# EAGLE design 32nbIoT-1.2 (EAGLE 9.0.0)
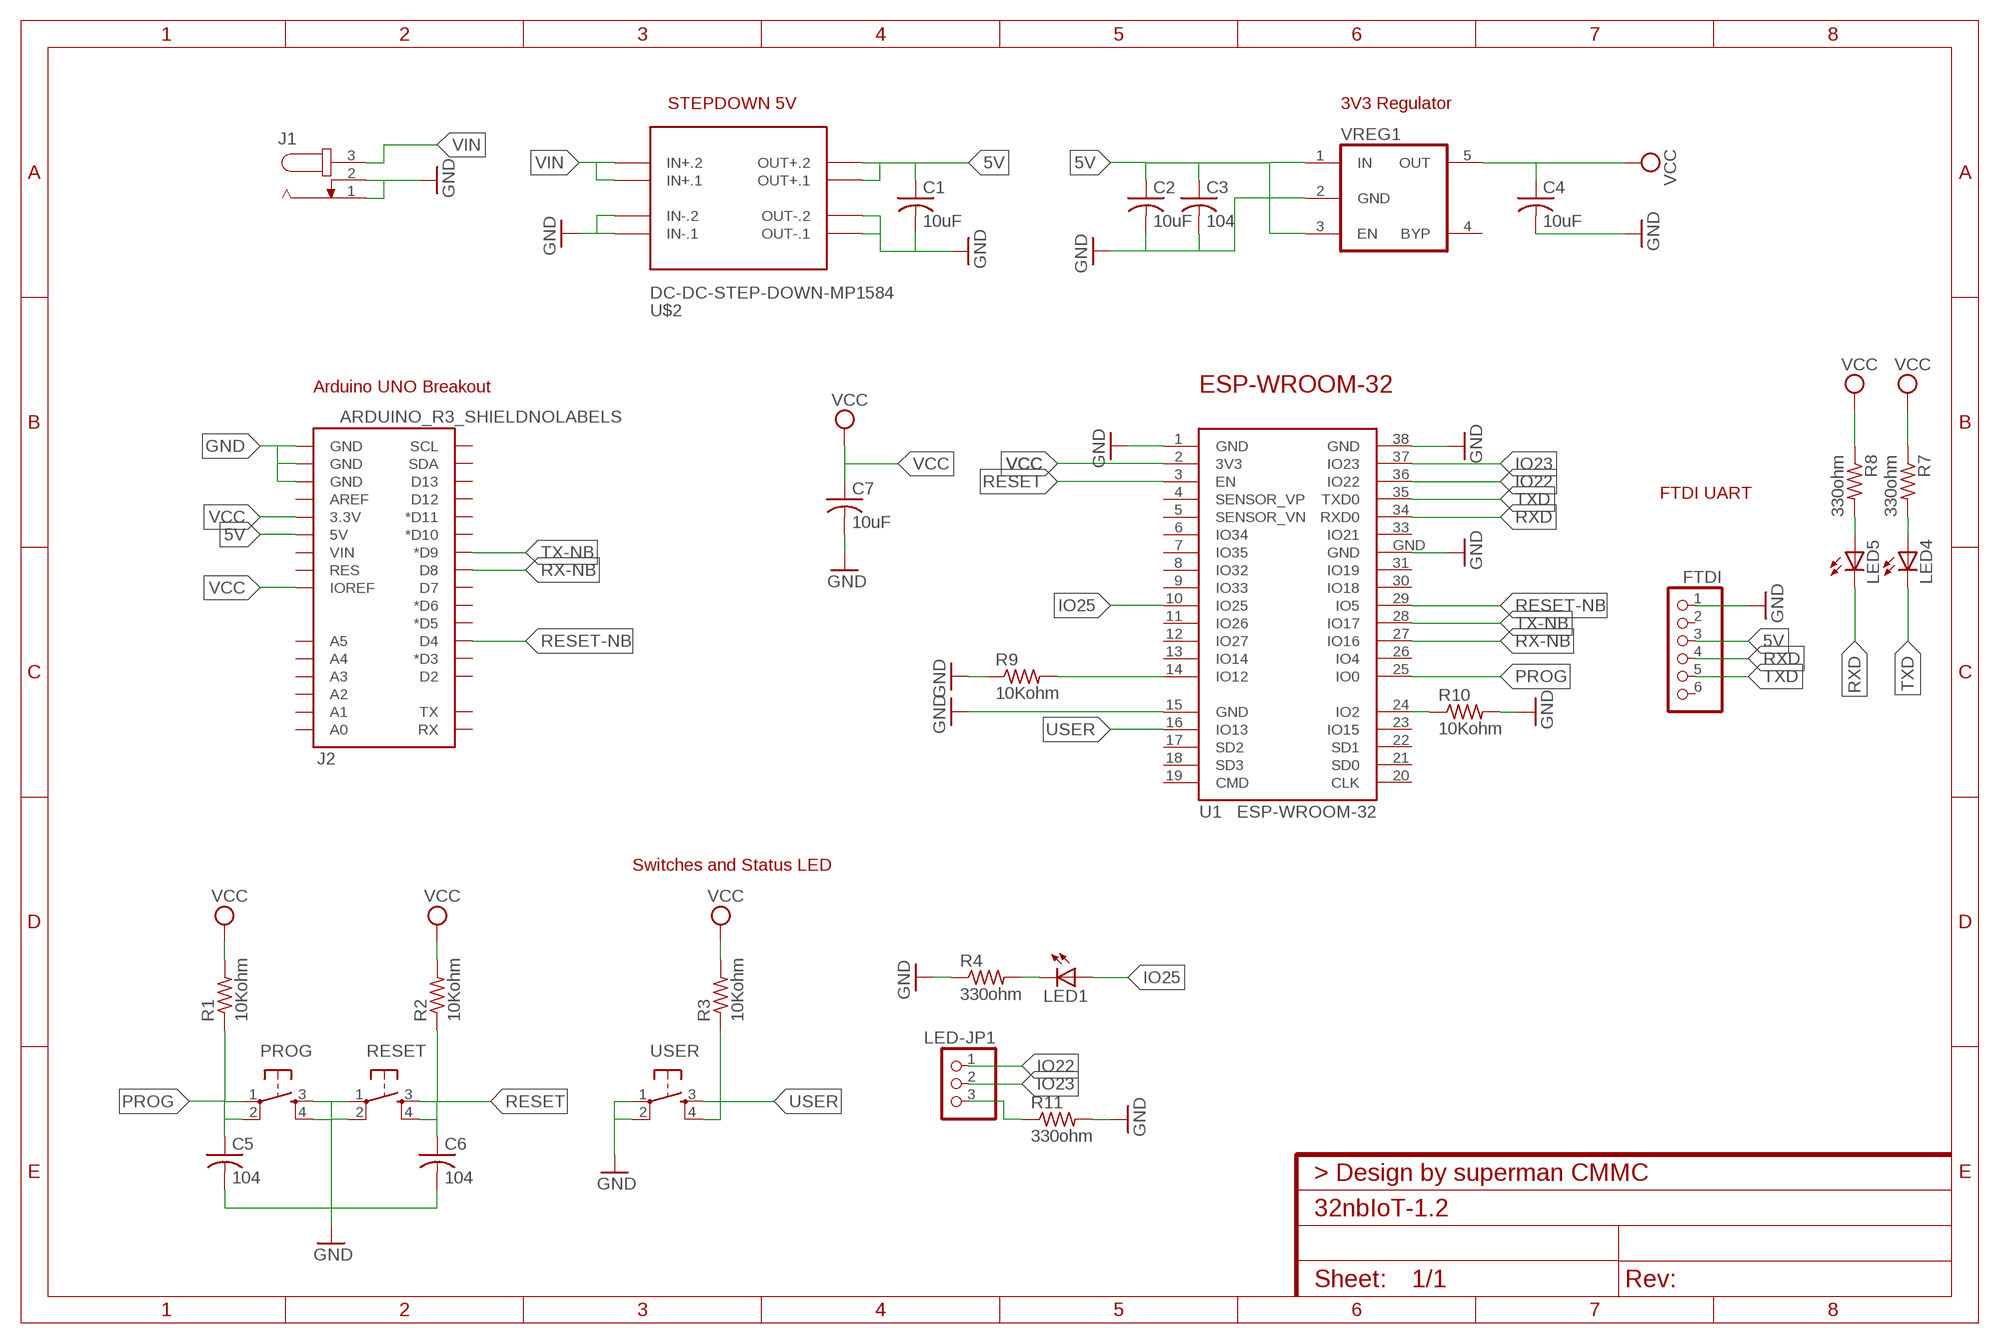
[diagram p0: schematic, sheet 1]

## Parts
C1  10uF  C-USC0805  [C0805]
C2  10uF  C-USC0805  [C0805]
C3  104  C-USC0805  [C0805]
C4  10uF  C-USC0805  [C0805]
C5  104  C-USC0805  [C0805]
C6  104  C-USC0805  [C0805]
C7  10uF  C-USC0805  [C0805]
FTDI  PINHD-1X6  [1X06]
J1  JACK-PLUG1  [SPC4078]
J2  ARDUINO_R3_SHIELDNOLABELS  [UNO_R3_SHIELD_NOLABELS]
LED1  LEDCHIPLED_0805  [CHIPLED_0805]
LED4  LEDCHIPLED_0805  [CHIPLED_0805]
LED5  LEDCHIPLED_0805  [CHIPLED_0805]
LED-JP1  PINHD-1X3/90  [1X03/90]
PROG  TAC_SWITCHPTH  [TACTILE-PTH]
R1  10Kohm  R-US_R0805W  [R0805W]
R2  10Kohm  R-US_R0805W  [R0805W]
R3  10Kohm  R-US_R0805W  [R0805W]
R4  330ohm  R-US_R0805W  [R0805W]
R7  330ohm  R-US_R0805W  [R0805W]
R8  330ohm  R-US_R0805W  [R0805W]
R9  10Kohm  R-US_R0805W  [R0805W]
R10  10Kohm  R-US_R0805W  [R0805W]
R11  330ohm  R-US_R0805W  [R0805W]
RESET  TAC_SWITCHPTH  [TACTILE-PTH]
U1  ESP-WROOM-32  [ESP-WROOM-32]
U$2  DC-DC-STEP-DOWN-MP1584  [DC-DC-STEP-DOWN-MP1584]
USER  TAC_SWITCHPTH  [TACTILE-PTH]
VREG1  VREG_5PINS-SOT-23-5  [SOT-23-5]

## Nets
5V: C1.1 C2.1 C3.1 FTDI.3 J2.5V U$2.OUT+.1 U$2.OUT+.2 VREG1.1(IN) VREG1.3(EN)
GND: C1.2 C2.2 C3.2 C4.2 C5.2 C6.2 C7.2 FTDI.1 J1.1 J1.2 J2.GND@0(GND) J2.GND@1(GND) J2.GND@2(GND) PROG.3 PROG.4 R4.1 R9.1 R10.2 R11.2 RESET.1 RESET.2 U1.1(GND) U1.15(GND) U1.38(GND) U1.GND U$2.IN-.1 U$2.IN-.2 U$2.OUT-.1 U$2.OUT-.2 USER.1 USER.2 VREG1.2(GND)
IO22: LED-JP1.1 U1.36(IO22)
IO23: LED-JP1.2 U1.37(IO23)
IO25: LED1.A U1.10(IO25)
N$1: R10.1 U1.24(IO2)
N$2: R9.2 U1.14(IO12)
N$3: LED1.C R4.2
N$4: LED-JP1.3 R11.1
N$7: LED4.A R7.2
N$8: LED5.A R8.2
PROG: C5.1 PROG.1 PROG.2 R1.1 U1.25(IO0)
RESET: C6.1 R2.1 RESET.3 RESET.4 U1.3(EN)
RESET-NB: J2.D4 U1.29(IO5)
RX-NB: J2.D8 U1.27(IO16)
RXD: FTDI.4 LED5.C U1.34(RXD0)
TX-NB: J2.D9(*D9) U1.28(IO17)
TXD: FTDI.5 LED4.C U1.35(TXD0)
USER: R3.1 U1.16(IO13) USER.3 USER.4
VCC: C4.1 C7.1 J2.3.3V J2.IOREF R1.2 R2.2 R3.2 R7.1 R8.1 U1.2(3V3) VREG1.5(OUT)
VIN: J1.3 U$2.IN+.1 U$2.IN+.2
Unconnected: FTDI.2 FTDI.6 J2.A0 J2.A1 J2.A2 J2.A3 J2.A4 J2.A5 J2.AREF J2.D2 J2.D3(*D3) J2.D5(*D5) J2.D6(*D6) J2.D7 J2.D10(*D10) J2.D11(*D11) J2.D12 J2.D13 J2.RES J2.RX J2.SCL J2.SDA J2.TX J2.VIN U1.4(SENSOR_VP) U1.5(SENSOR_VN) U1.6(IO34) U1.7(IO35) U1.8(IO32) U1.9(IO33) U1.11(IO26) U1.12(IO27) U1.13(IO14) U1.17(SD2) U1.18(SD3) U1.19(CMD) U1.20(CLK) U1.21(SD0) U1.22(SD1) U1.23(IO15) U1.26(IO4) U1.30(IO18) U1.31(IO19) U1.33(IO21) VREG1.4(BYP)

## Notes on the sheet
- STEPDOWN 5V | 3V3 Regulator
- Arduino UNO Breakout | ESP-WROOM-32
- FTDI UART
- Switches and Status LED

## Library data of the parts
C1-C7 = adafruit:C-US: CAPACITOR, American symbol
FTDI = pinhead:PINHD-1X6: PIN HEADER
J1 = con-jack:JACK-PLUG: DC POWER JACK Power Jack, DC, Right Angle, Through Hole, Rated 5A at 16VDC, PC Terminals Distributor: Farnell (www.Farnell.de) Drawing: 84N1161.pdf / 84N1162.pdf Manufacturer: SPC Technology (www.spctechnology.com) Type: SPC4077 / SPC 4078; OC_FARNELL: unknown; OC_NEWARK: unknown
J2 = SparkFun-Boards:ARDUINO_R3_SHIELD: Shield form compatible with the Arduino Uno R3.
LED1 LED4 LED5 = adafruit:LED: LED OSRAM: - CHIPLED LG R971, LG N971, LY N971, LG Q971, LY Q971, LO R971, LY R971 LH N974, LH R974 LS Q976, LO Q976, LY Q976 LO Q996 - Hyper CHIPLED LW Q18S LB Q993, LB Q99A, LB R99A - SideLED LS A670, LO A670, LY A670, LG A670, LP A670 LB A673, LV A673, LT A673, LW A673 LH A674 LY A675 LS A676, LA A676, LO A676, LY A676, LW A676 LS A679, LY A679, LG A679 - Hyper Micro SIDELED® LS Y876, LA Y876, LO Y876, LY Y876 LT Y87S - SmartLED LW L88C, LW L88S LB L89C, LB L89S, LG L890 LS L89K, LO L89K, LY L89K LS L896, LA L896, LO L896, LY L896 - TOPLED LS T670, LO T670, LY T670, LG T670, LP T670 LSG T670, LSP T670, LSY T670, LOP T670, LYG T670 LG T671, LOG T671, LSG T671 LB T673, LV T673, LT T673, LW T673 LH T674 LS T676, LA T676, LO T676, LY T676, LB T676, LH T676, LSB T676, LW T676 LB T67C, LV T67C, LT T67C, LS T67K, LO T67K, LY T67K, LW E67C LS E67B, LA E67B, LO E67B, LY E67B, LB E67C, LV E67C, LT E67C LW T67C LS T679, LY T679, LG T679 LS T770, LO T770, LY T770, LG T770, LP T770 LB T773, LV T773, LT T773, LW T773 LH T774 LS E675, LA E675, LY E675, LS T675 LS T776, LA T776, LO T776, LY T776, LB T776 LHGB T686 LT T68C, LB T68C - Hyper Mini TOPLED® LB M676 - Mini TOPLED Santana® LG M470 LS M47K, LO M47K, LY M47K Source: http://www.osram.convergy.de/
LED-JP1 = pinhead:PINHD-1X3: PIN HEADER
PROG RESET USER = SparkFun-Retired:TAC_SWITCH: Momentary Switch Button commonly used for reset or general input. Spark Fun Electronics SKU : COM-00097 SMT- SWCH-08247
R1-R4 R7-R11 = adafruit:R-US_: RESISTOR, American symbol
U1 = esp32:ESP-WROOM-32: Espressif Systems ESP-WROOM-32
U$2 = diy-modules:DC-DC-STEP-DOWN-MP1584: DC/DC Step-Down Regulator based on MP1584 chip MP1584 datasheet available here: http://www.haoyuelectronics.com/Attachment/MP1584/MP1584.pdf Click here to find device on ebay.com <http://www.ebay.com/sch/mp1584+module>
VREG1 = dp_devices:VREG_5PINS: 5 pins voltage regulator

## Board
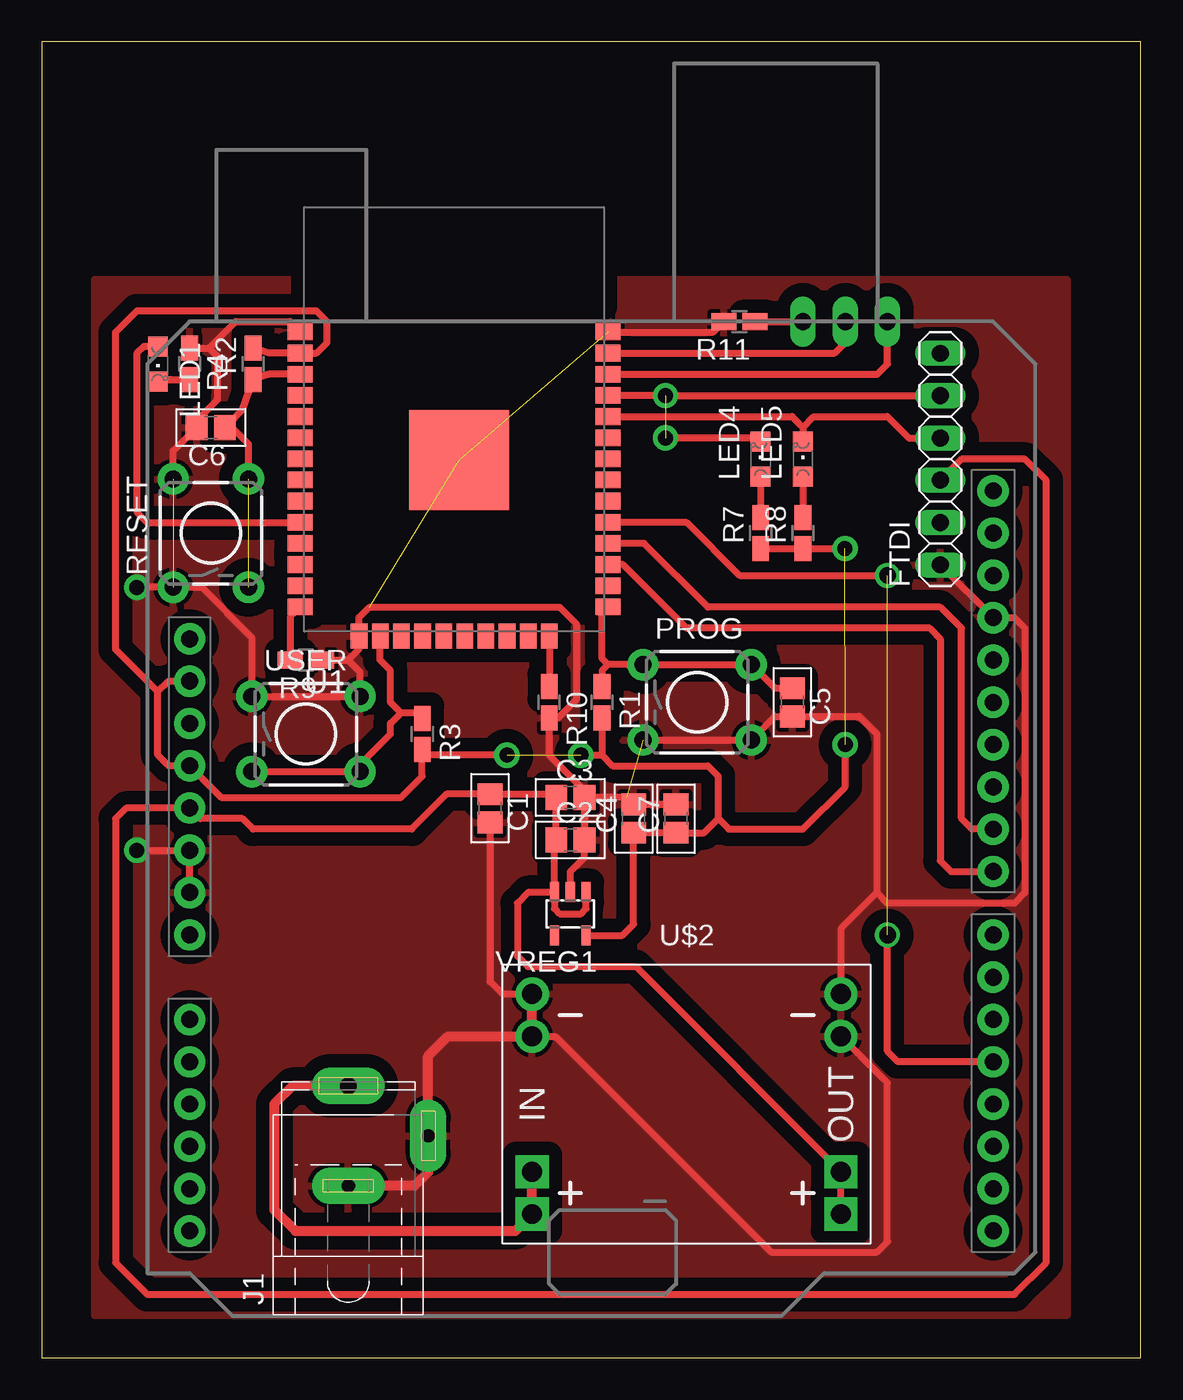
[diagram p1: board, top side]
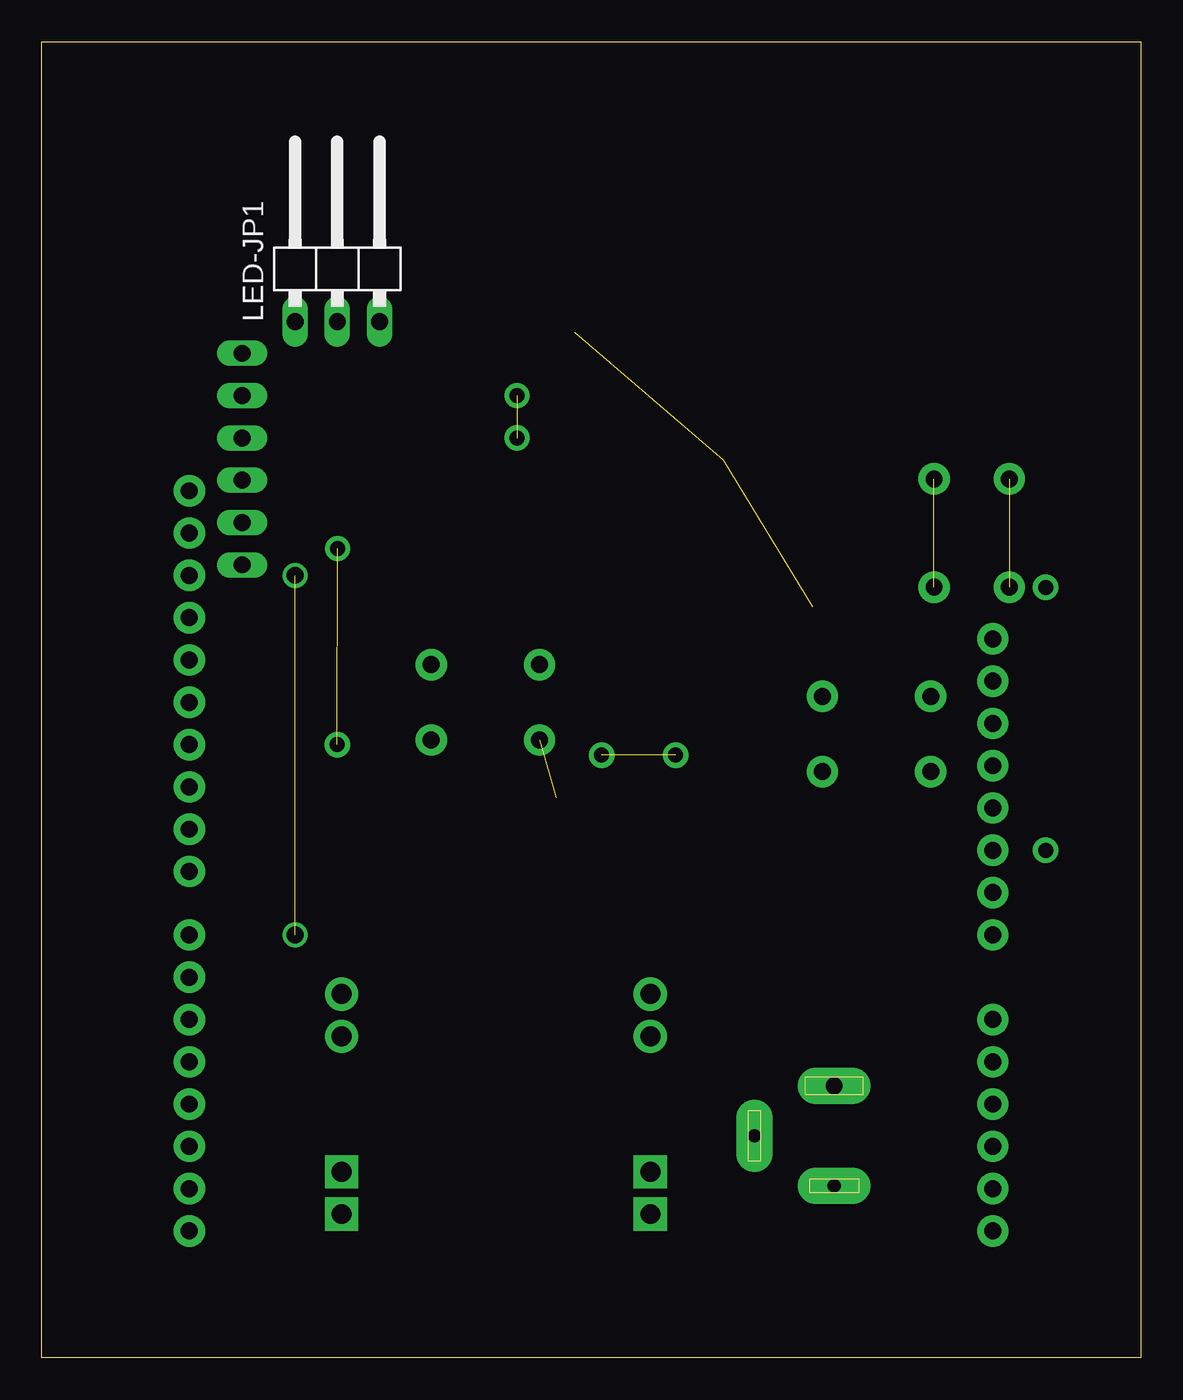
[diagram p2: board, bottom side, seen from below]

Size 66.02 x 79.05 mm. Coordinates in mm from the lower left corner, seen from the top.
Outline: 0,0 66.02,0 66.02,79.05 0,79.05 0,0
Copper layers (1*16): Top 0.035mm / dielectric 1.5mm / Bottom 0.035mm
Design rules "default": minimum track width 6mil, minimum drill 0.35mm, track to track 6mil, track to pad 6mil, pad to pad 6mil, via to via 6mil, smd to smd 6mil, copper to edge 40mil, drill to drill 6mil, minimum pad ring 10mil, minimum via ring 8mil, stop-mask expansion 4mil, vias tented up to drill 0mil, thermal gap 10mil

### Footprints (pad centres in the part's own frame; a part is rotated, then mirrored left to right if it is on the bottom)
C0805 = smd 1.3 x 1.5: 1 -0.85,0; 2 0.85,0
1X06 = drill 1.016 long: 1 -6.35,0; 2 -3.81,0; 3 -1.27,0; 4 1.27,0; 5 3.81,0; 6 6.35,0
SPC4078 = drill 0.8 pad 2.184 long: 1 -3,0; 2 0,-4.8 | drill 1 pad 2.184 long: 3 3,0
UNO_R3_SHIELD_NOLABELS = drill 1.016 pad 1.88: 3.3V 50.8,26.67; 5V 50.8,29.21; A0 50.8,41.91; A1 50.8,44.45; A2 50.8,46.99; A3 50.8,49.53; A4 50.8,52.07; A5 50.8,54.61; AREF 2.54,15.24; D2 2.54,49.53; D3 2.54,46.99; D4 2.54,44.45; D5 2.54,41.91; D6 2.54,39.37; D7 2.54,36.83; D8 2.54,33.02; D9 2.54,30.48; D10 2.54,27.94; D11 2.54,25.4; D12 2.54,22.86; D13 2.54,20.32; GND@0 50.8,31.75; GND@1 50.8,34.29; GND@2 2.54,17.78; IOREF 50.8,21.59; NC 50.8,19.05; RES 50.8,24.13; RX 2.54,54.61; SCL 2.54,10.16; SDA 2.54,12.7; TX 2.54,52.07; VIN 50.8,36.83
CHIPLED_0805 = smd 1.2 x 1.2: A 0,-1.05; C 0,1.05
1X03/90 = drill 1.016 long: 1 -2.54,-3.81; 2 0,-3.81; 3 2.54,-3.81
TACTILE-PTH = drill 1.016 pad 1.88: 1 -3.251,2.261; 2 3.251,2.261; 3 -3.251,-2.261; 4 3.251,-2.261
R0805W = smd 1.5 x 1: 1 -0.94,0; 2 0.94,0
ESP-WROOM-32 = smd 1.5 x 1: 1 -9.25,7; 2 -9.25,5.73; 3 -9.25,4.46; 4 -9.25,3.19; 5 -9.25,1.92; 6 -9.25,0.65; 7 -9.25,-0.62; 8 -9.25,-1.89; 9 -9.25,-3.16; 10 -9.25,-4.43; 11 -9.25,-5.7; 12 -9.25,-6.97; 13 -9.25,-8.24; 14 -9.25,-9.51; 25 9.25,-9.51; 26 9.25,-8.24; 27 9.25,-6.97; 28 9.25,-5.7; 29 9.25,-4.43; 30 9.25,-3.16; 31 9.25,-1.89; 32 9.25,-0.62; 33 9.25,0.65; 34 9.25,1.92; 35 9.25,3.19; 36 9.25,4.46; 37 9.25,5.73; 38 9.25,7 | smd 1 x 1.5: 15 -5.7,-11.25; 16 -4.43,-11.25; 17 -3.16,-11.25; 18 -1.89,-11.25; 19 -0.62,-11.25; 20 0.65,-11.25; 21 1.92,-11.25; 22 3.19,-11.25; 23 4.46,-11.25; 24 5.73,-11.25 | smd 6 x 6: GND 0.3,-0.7
DC-DC-STEP-DOWN-MP1584 = drill 1.2 pad 2 square: IN+.1 -9.271,-4.064; IN+.2 -9.271,-6.604; OUT+.1 9.271,-4.064; OUT+.2 9.271,-6.604 | drill 1.2 pad 2: IN-.1 -9.271,6.604; IN-.2 -9.271,4.064; OUT-.1 9.271,6.604; OUT-.2 9.271,4.064
SOT-23-5 = smd 0.55 x 1.2: 1 -0.95,-1.3; 2 0,-1.3; 3 0.95,-1.3; 4 0.95,1.3; 5 -0.95,1.3

### Placement (x,y rotation side)
C1  26.93,33 270 top
C2  31.75,31.11 0 top
C3  31.75,33.66 0 top
C4  35.56,32.38 90 top
C5  45.09,39.37 270 top
C6  10.16,55.88 180 top
C7  38.1,32.38 90 top
FTDI  53.98,53.98 90 top
J1  18.41,13.34 90 top
J2  59.69,62.23 180 top
LED1  6.99,59.69 180 top
LED4  43.18,53.98 0 top
LED5  45.72,53.98 0 top
LED-JP1  48.26,66.04 0 bottom
PROG  39.37,39.37 0 top
R1  33.66,39.37 270 top
R2  12.7,59.69 90 top
R3  22.86,37.47 270 top
R4  8.89,59.69 270 top
R7  43.18,49.53 90 top
R8  45.72,49.53 90 top
R9  15.88,41.91 180 top
R10  30.48,39.37 270 top
R11  41.91,62.23 180 top
RESET  10.16,49.53 90 top
U1  24.77,54.61 0 top
U$2  38.73,15.24 0 top
USER  15.88,37.47 0 top
VREG1  31.75,26.67 180 top

### Tracks (layer width: path | path; a pad name or v marks a point on that pad's centre or on a via)
5V
  Top 0.406: VREG1.3 30.8,31.02 C2.1 C3.1 30.7,33.85 C1.1 24.33,33.85 22.23,31.75 12.7,31.75 12.06,32.38 9.53,32.38 J2.5V 5.08,33.02 4.45,32.38 4.45,5.71 6.35,3.81 58.42,3.81 60.33,5.71 60.33,52.7 59.05,53.98 55.24,53.98 FTDI.3 | VREG1.3 30.8,26.98 31.11,26.67 32.38,26.67 32.7,26.98 VREG1.1 | VREG1.3 30.77,27.94 29.21,27.94 28.57,27.3 28.57,24.13 29.21,23.5 35.69,23.5 U$2.OUT+.1 U$2.OUT+.2
GND  (via drill 0.9 pad 1.52)  (4 unrouted)
  Top 0.406: U1.38 40.35,61.61 R11.2 | C6.2 9.31,56.38 | R4.1 10.06,60.63 | C6.2 9.31,56.3 10.54,57.53 10.54,60.15 10.06,60.63 | 15.28,61.61 U1.1 14.89,62.23 11.66,62.23 10.06,60.63 | RESET.2 7.9,54.47 C6.2 | R9.1 18.41,41.91 | 18.41,41.91 19.07,42.56 U1.15 19.07,44.47 19.68,45.09 31.11,45.09 32.12,44.08 32.12,39.53 31.02,38.43 R10.2 | 18.41,41.91 19.13,41.2 USER.2 USER.1 12.62,43.26 9.6,46.28 RESET.1 5.72,46.28 v5.71,46.27 | R10.2 30.79,38.73 | v5.71,30.48 J2.GND@0 J2.GND@1 | C3.2 C2.2 32.6,30.05 31.75,29.2 VREG1.2 | C3.2 35.14,33.66 C4.2 C7.2 | FTDI.1 J2.GND@2 58.42,44.45 59.05,43.81 59.05,27.94 58.42,27.3 50.8,27.3 50.16,27.94 | PROG.3 PROG.4 44.03,38.52 C5.2 49.11,38.52 50.16,37.47 50.16,27.94 | R10.2 30.48,36.2 32.6,34.08 C3.2 | U$2.IN-.1 27.69,21.84 26.93,22.6 C1.2 | U$2.OUT-.1 48.01,25.78 50.16,27.94 | U$2.IN-.2 30.86,19.3 43.81,6.35 50.16,6.35 50.8,6.99 50.8,16.51 U$2.OUT-.2
  Top 0.61: J1.1 22.4,10.34 23.21,11.15 J1.2 23.21,18.14 24.38,19.3 U$2.IN-.2 U$2.IN-.1
  pour Top (isolate 0.813): 34.29,64.77 61.59,64.77 61.59,2.54 3.17,2.54 3.17,64.77 15.88,64.77 15.88,43.81 33.66,43.81
IO22
  Top 0.406: U1.36 50.18,59.07 50.8,59.69 LED-JP1.1
IO23
  Top 0.406: U1.37 47.64,60.34 48.26,60.96 LED-JP1.2
IO25
  Top 0.406: LED1.A 6.13,60.74 5.71,60.33 5.71,50.8 6.35,50.16 15.5,50.16 U1.10
N$1
  Top 0.406: U1.24 30.5,40.33 R10.1
N$2
  Top 0.406: U1.14 14.94,44.52 R9.2
N$3
  Top 0.406: LED1.C 7.73,58.75 R4.2
N$4
  Top 0.406: R11.1 LED-JP1.3
N$7
  Top 0.406: LED4.A R7.2
N$8
  Top 0.406: LED5.A R8.2
PROG
  Top 0.406: C5.1 44.03,40.22 PROG.2 PROG.1 | 35.2,41.63 PROG.1 | PROG.1 34.01,41.63 | 34.01,41.63 33.66,41.27 R1.1 | 34.01,41.63 33.66,41.99 33.66,44.74 U1.25
RESET  (1 unrouted)
  Top 0.406: U1.3 13.65,59.07 R2.1 12.06,56.94 11.22,56.09 | C6.1 11.22,56.09 | RESET.4 12.42,54.89 11.22,56.09
RESET-NB  (via drill 1 pad 1.15)  (1 unrouted)
  Top 0.406: J2.D4 51.44,17.78 50.8,18.41 v50.8,25.4 | U1.29 38.72,50.18 41.91,46.99 v50.8,46.99
RX-NB
  Top 0.406: J2.D8 54.61,29.21 53.98,29.84 53.98,43.18 53.34,43.81 38.73,43.81 34.91,47.64 U1.27
RXD
  Top 0.406: FTDI.4 52.07,55.24 50.78,56.53 50.77,56.52 46.35,56.52 45.72,55.88 | 45.72,55.88 LED5.C | U1.34 45.07,56.53 45.72,55.88
TX-NB
  Top 0.406: J2.D9 55.88,31.75 55.24,32.38 55.24,43.81 53.98,45.09 40.01,45.09 36.18,48.91 U1.28
  Top 0.61: 34.03,48.9 U1.28
TXD  (via drill 0.9 pad 1.52)  (1 unrouted)
  Top 0.406: 53.96,57.8 FTDI.5 v37.47,57.78 37.45,57.8 U1.35 | LED4.C 42.96,55.24 v37.47,55.24
USER
  Top 0.406: R3.1 22.53,38.73 21.59,38.73 | 21.59,38.73 20.95,39.37 20.95,41.27 20.32,41.91 20.32,43.34 U1.16 | 21.59,38.73 20.95,38.1 20.95,37.47 19.13,35.64 USER.4 USER.3
VCC  (via drill 0.9 pad 1.52)  (2 unrouted)
  Top 0.406: R7.1 R8.1 48.23,48.59 v48.25,48.6 | R2.2 13.62,60.34 U1.2 16.52,60.34 17.14,60.96 17.14,62.23 16.51,62.87 5.71,62.87 4.45,61.59 4.45,42.55 6.99,40.01 | 6.99,40.01 6.99,36.2 7.62,35.56 J2.3.3V 10.79,33.66 21.59,33.66 22.86,34.92 22.86,36.2 | 6.99,40.01 7.62,40.64 J2.IOREF | 22.86,36.2 R3.2 23.16,36.83 | C7.1 C4.1 35.56,26.04 34.9,25.37 VREG1.5 | C7.1 | C7.1 39.79,31.54 40.64,32.38 | 40.64,32.38 40.64,34.92 40.01,35.56 34.29,35.56 33.66,36.2 | R1.2 33.66,36.2 | v32.38,36.2 33.66,36.2 | v27.94,36.2 22.86,36.2 | 40.64,32.38 41.27,31.75 45.72,31.75 48.26,34.29 v48.26,36.83
VIN
  Top 0.61: J1.3 15.06,16.34 13.97,15.24 13.97,8.89 15.24,7.62 28.45,7.62 U$2.IN+.2 U$2.IN+.1